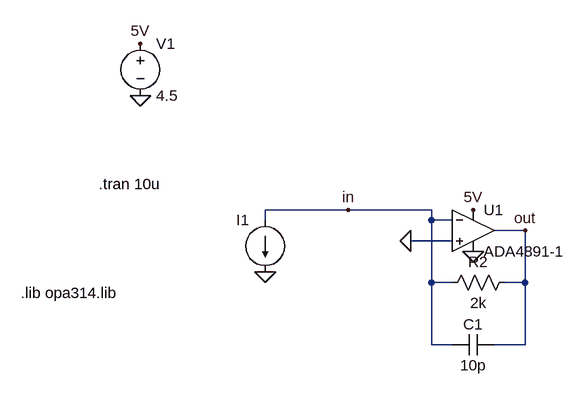
[diagram p0: schematic output.asc]
output.asc, the LTspice schematic file:
Version 4
SHEET 1 912 680
WIRE 448 176 320 176
WIRE 576 176 448 176
WIRE 320 192 320 176
WIRE 576 192 576 176
WIRE 608 192 576 192
WIRE 720 208 672 208
WIRE 608 224 544 224
WIRE 576 288 576 192
WIRE 608 288 576 288
WIRE 720 288 720 208
WIRE 720 288 688 288
WIRE 576 384 576 288
WIRE 608 384 576 384
WIRE 720 384 720 288
WIRE 720 384 672 384
FLAG 320 272 0
FLAG 128 0 0
FLAG 128 -80 5V
FLAG 640 176 5V
FLAG 640 240 0
FLAG 448 176 in
FLAG 720 208 out
FLAG 544 224 0
SYMBOL current 320 192 M0
WINDOW 3 24 80 Invisible 2
WINDOW 123 0 0 Left 0
WINDOW 39 0 0 Left 0
SYMATTR Value EXP(13u 1.3m 200n 1n 0 1000n)
SYMATTR InstName I1
SYMBOL voltage 128 -96 R0
WINDOW 123 0 0 Left 0
WINDOW 39 0 0 Left 0
SYMATTR InstName V1
SYMATTR Value 4.5
SYMBOL OpAmps\\ADA4891-1 640 144 R0
SYMATTR InstName U1
SYMBOL res 704 272 R90
WINDOW 0 0 56 VBottom 2
WINDOW 3 32 56 VTop 2
SYMATTR InstName R2
SYMATTR Value 2k
SYMBOL cap 672 368 R90
WINDOW 0 0 32 VBottom 2
WINDOW 3 32 32 VTop 2
SYMATTR InstName C1
SYMATTR Value 10p
TEXT 64 136 Left 2 !.tran 10u
TEXT -56 304 Left 2 !.lib opa314.lib

The netlist it stands for:
* output.asc
I1 in 0 EXP(13u 1.3m 200n 1n 0 1000n)
V1 5V 0 4.5
XU1 0 in 5V 0 out ADA4891-1  ; pins In+ In- V+ V- OUT
R2 out in 2k
C1 out in 10p
.tran 10u
.lib opa314.lib
.backanno
.end